# Altium schematic sheet LS1-LS2_audio.SchDoc
size A
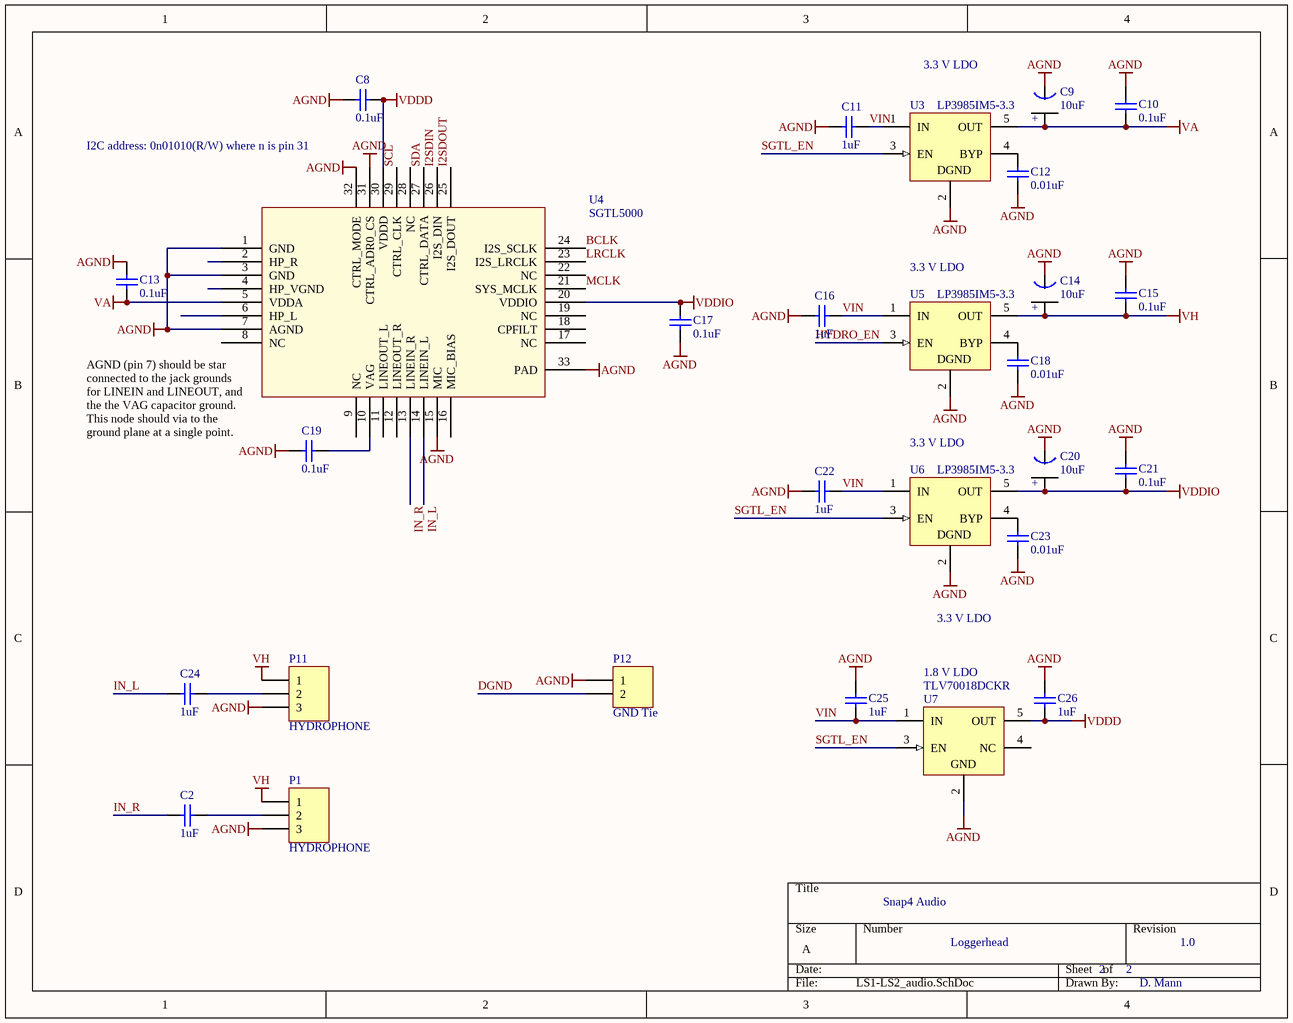
[diagram p0: LS1-LS2_audio.SchDoc]

## Parts
C2  1uF  [0402]
C8  0.1uF  [0402]
C9  10uF  [Tant0805]
C10  0.1uF  [0402]
C11  1uF  [0402]
C12  0.01uF  [0402]
C13  0.1uF  [0402]
C14  10uF  [Tant0805]
C15  0.1uF  [0402]
C16  1uF  [0402]
C17  0.1uF  [0402]
C18  0.01uF  [0402]
C19  0.1uF  [0402]
C20  10uF  [Tant0805]
C21  0.1uF  [0402]
C22  1uF  [0402]
C23  0.01uF  [0402]
C24  1uF  [0402]
C25  1uF  [0402]
C26  1uF  [0402]
P1  HYDROPHONE  [HDR1X3]
P11  HYDROPHONE  [HDR1X3]
P12  GND Tie  [HDR1X2]
U3  LP3985IM5-3.3  [MF05A_N]
U4  SGTL5000  [QFN32]
U5  LP3985IM5-3.3  [MF05A_N]
U6  LP3985IM5-3.3  [MF05A_N]
U7  TLV70018DCKR  [TI-DCK5_V]

## Nets
AGND: C8.2 C9.1(GND) C10.2 C11.2 C12.2 C13.2 C14.1(GND) C15.2 C16.2 C17.2 C18.2 C19.2 C20.1(GND) C21.2 C22.2 C23.2 C25.2 C26.2 P1.3 P11.3 P12.1 U3.2(GND) U4.1(GND) U4.3(GND) U4.7(AGND) U4.15(MIC) U4.31(CTRL_ADR0_CS) U4.32(CTRL_MODE) U4.33(PAD) U5.2(GND) U6.2(GND) U7.2(GND)
VA: C9.2(+) C10.1 C13.1 U3.5(OUT) U4.5(VDDA)
VDDD: C8.1 C26.1 U4.30(VDDD) U7.5(OUT)
VDDIO: C17.1 C20.2(+) C21.1 U4.20(VDDIO) U6.5(OUT)
VH: C14.2(+) C15.1 P1.1 P11.1 U5.5(OUT)
BCLK: U4.24(I2S_SCLK)
DGND: P12.2
HYDRO_EN: U5.3(EN)
I2SDIN: U4.26(I2S_DIN)
I2SDOUT: U4.25(I2S_DOUT)
IN_L: C24.2 U4.14(LINEIN_L)
IN_R: C2.2 U4.13(LINEIN_R)
LRCLK: U4.23(I2S_LRCLK)
MCLK: U4.21(SYS_MCLK)
SCL: U4.29(CTRL_CLK)
SDA: U4.27(CTRL_DATA)
SGTL_EN: U3.3(EN) U6.3(EN) U7.3(EN)
VIN: C11.1 C16.1 C22.1 C25.1 U3.1(IN) U5.1(IN) U6.1(IN) U7.1(IN)
NetC2_1: C2.1 P1.2
NetC12_1: C12.1 U3.4(BYP)
NetC18_1: C18.1 U5.4(BYP)
NetC19_1: C19.1 U4.10(VAG)
NetC23_1: C23.1 U6.4(BYP)
NetC24_1: C24.1 P11.2

Not connected (* = marked no-connect by the designer): U4 2(HP_R) 4(HP_VGND) 6(HP_L) 8(NC) 9(NC) 11(LINEOUT_L) 12(LINEOUT_R) 16(MIC_BIAS) 17(NC) 18(CPFILT) 19(NC) 22(NC) 28(NC); U7 4(NC)

## Notes on the sheet
- 3.3 V LDO
- I2C address: 0n01010(R/W) where n is pin 31
- (near U5) 3.3 V LDO
- (near U4) AGND (pin 7) should be star connected to the jack grounds for LINEIN and LINEOUT, and the the VAG capacitor ground. This node should via to the ground plane at a single point.
- (near U6) 3.3 V LDO
- (near U7) 1.8 V LDO
- Snap4 Audio
- Loggerhead
- 2
- 1.0
- D. Mann
- (in symbol LP3985IM5-3.3) DGND

## Library data of the parts
C2 C11 C12 C16 C18 C22-C26 = C0402: Ceramic Chip Capacitor - Standard; Note: Footprint corresponds to dimensions for bulk cassette packaging. This case size has tightened tolerances.; Value: 0.1uF; Published: 17-Jul-2002; LatestRevisionDate: 19-Mar-2004; LatestRevisionNote: Silkscreen size reduced.; DatasheetDocument: Mar-2001; PackageDocument: Mar-2001; PackageReference: 0402; Publisher: Altium Limited; Code_JEITA: 0402; Code_IPC: 1005 [0402]; ComponentLink1Description: Manufacturer Link; ComponentLink1URL: http://www.kemet.com/; ComponentLink2Description: Datasheet; ComponentLink2URL: http://www.kemet.com/kemet/web/homepage/kechome.nsf/vapubfilesname/F3102TA.pdf/$file/F3102TA.pdf
C8 C10 C13 C15 C17 C19 C21 = C0402: Ceramic Chip Capacitor - Standard; Note: Footprint corresponds to dimensions for bulk cassette packaging. This case size has tightened tolerances.; Published: 17-Jul-2002; LatestRevisionDate: 19-Mar-2004; LatestRevisionNote: Silkscreen size reduced.; DatasheetDocument: Mar-2001; PackageDocument: Mar-2001; PackageReference: 0402; Publisher: Altium Limited; Code_JEITA: 0402; Code_IPC: 1005 [0402]; ComponentLink1Description: Manufacturer Link; ComponentLink1URL: http://www.kemet.com/; ComponentLink2Description: Datasheet; ComponentLink2URL: http://www.kemet.com/kemet/web/homepage/kechome.nsf/vapubfilesname/F3102TA.pdf/$file/F3102TA.pdf; Value: 0.1uF
C9 C14 C20 = Tant0805: Value: 10uF
P1 P11 = Header 3: Header, 3-Pin; LatestRevisionDate: 17-Jul-2002; LatestRevisionNote: Re-released for DXP Platform.; Publisher: Altium Limited
P12 = Header 2: Header, 2-Pin; LatestRevisionDate: 17-Jul-2002; LatestRevisionNote: Re-released for DXP Platform.; Publisher: Altium Limited
U3 U5 U6 = LP3985IM5-3.3: Micropower, 150mA Low-Noise Ultra Low-Dropout CMOS Voltage Regulator; Manufacturer: National Semiconductor; CompType: LDO IC; PackageTopMarking: LDQB*XTT; PowerWise: N; Published: 4-Dec-2008; DatasheetVersion: Aug-2005; PackageVersion: revD, Aug-2008; PackageReference: MF05A; Publisher: Altium Limited; PackageDescription: Molded SOT-23, .115 x .063 x .040 in Body, 5 Lead, .0375 in Pitch; PartNumber: LP3985IM5-3.3; RoHS: O; PinCount: 5; DigiKeyPartNumber: LP3985IM5-3.3CT-ND; ComponentLink1Description: LP3985 Datasheet; ComponentLink1URL: http://www.national.com/ds/LP/LP3985.pdf; ComponentLink2Description: LP3985 Web Page; ComponentLink2URL: http://www.national.com/pf/LP/LP3985.html; ComponentLink3Description: MF05A Package Page; ComponentLink3URL: http://www.national.com/packaging/folders/mf05a.html
U7 = TLV70018DCKR: Single Output LDO, 200 mA, Fixed 1.8 V Output, 2 to 5.5 V Input, with Low IQ, 5-pin SC70 (DCK), -40 to 125 degC, Green (RoHS & no Sb/Br); Manufacturer: Texas Instruments; Accuracy(%): 2; Fixed Output Options(V): 1.8; Iout(Max)(A): 0.2; Iq(Typ)(mA): 0.03; SubFamily: Single Channel LDO; Vdo(Typ)(mV): 175; Vin(Max)(V): 5.5; DatasheetVersion: SLVSA00D; PackageVersion: 4093553-3/G; PackageReference: DCK5; PackageDescription: 5-Pin Plastic Small-Outline, Body 2 x 1.25 mm, Pitch 0.65 mm; Supplier 1: Digi-Key; Supplier Part Number 1: 296-32409-2-ND; Supplier 2: Digi-Key; Supplier Part Number 2: 296-32409-1-ND; Supplier 3: Digi-Key; Supplier Part Number 3: 296-32409-6-ND; Supplier 4: Newark; Supplier Part Number 4: 55R7461; Supplier 5: Mouser; Supplier Part Number 5: 595-TLV70018DCKR; Eco-Plan: Green (RoHS & no Sb/Br); Vin(Min)(V): 2; Vout Adj(Max)(V): 1.8; Vout Adj(Min)(V): 1.8; Mounting Technology: Surface Mount; Code_JEDEC: MO-203; PartNumber: TLV70018DCKR; ComponentLink1Description: Manufacturer URL; ComponentLink1URL: http://www.ti.com/; ComponentLink2Description: Datasheet; ComponentLink2URL: http://www.ti.com/general/docs/lit/getliterature.tsp?genericPartNumber=TLV70018&fileType=pdf; ComponentLink3Description: Package Specification; ComponentLink3URL: http://www.ti.com/litv/pdf/mpds025f